# EAGLE schematic matrix (EAGLE 8.4.0)
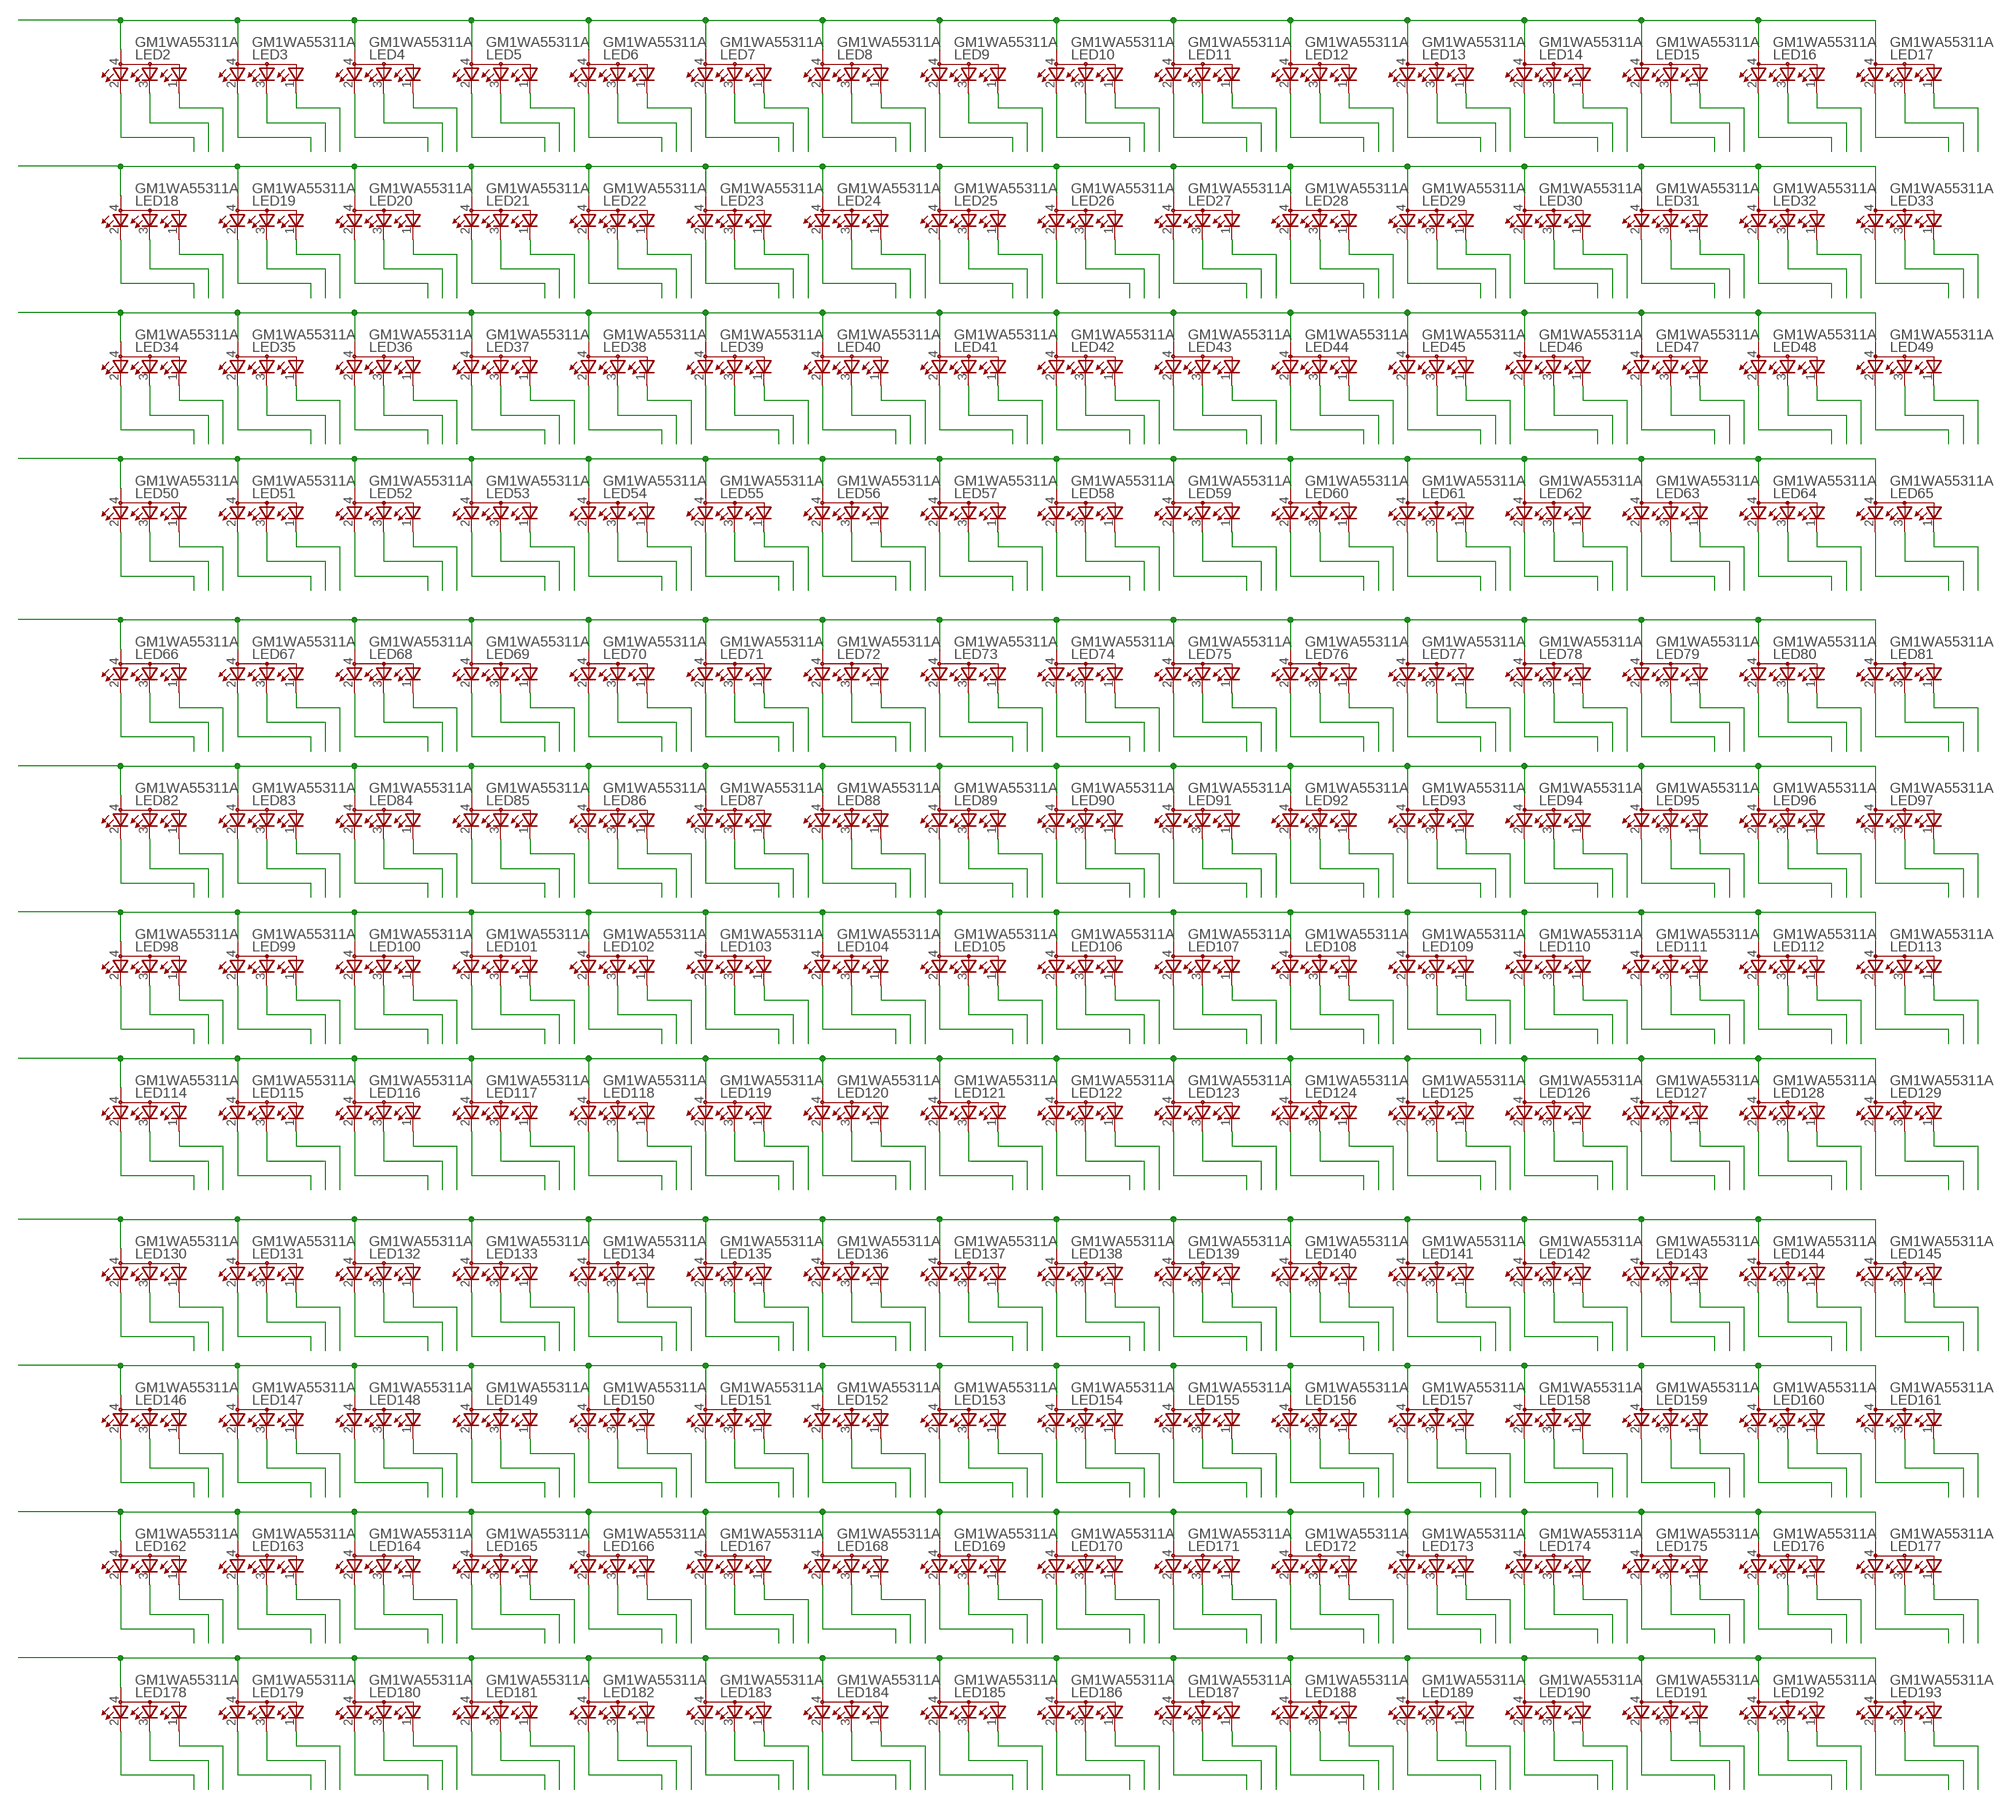
[diagram p0: schematic, sheet 1, part 1 of 3]
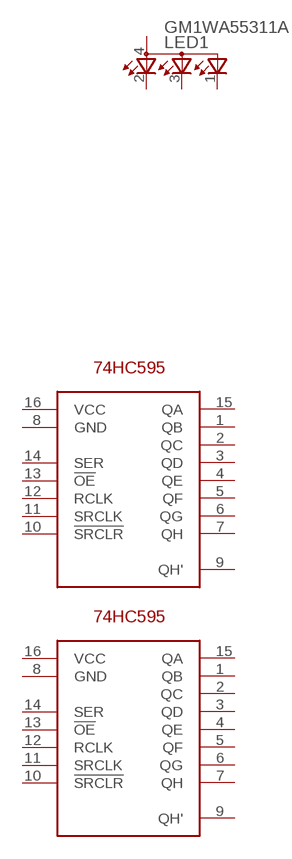
[diagram p1: schematic, sheet 1, part 2 of 3]
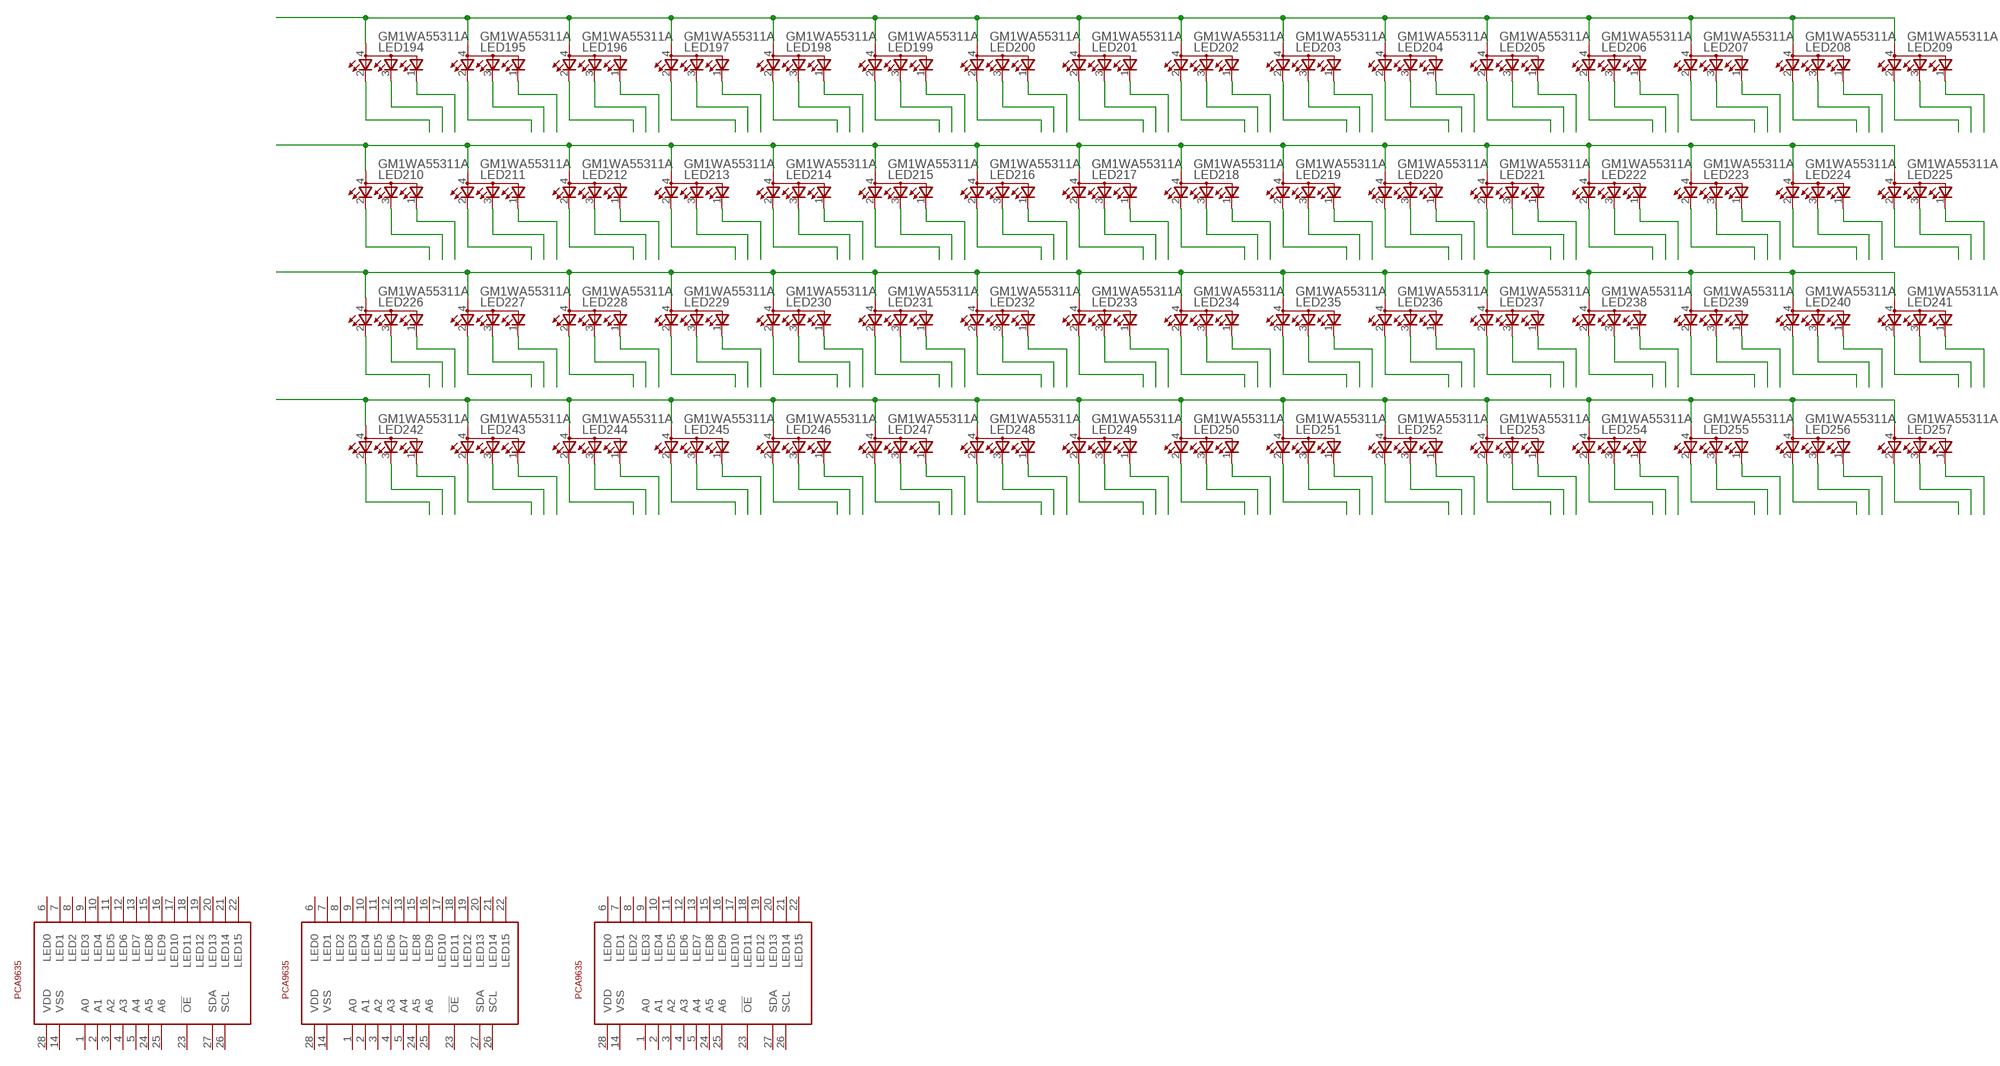
[diagram p2: schematic, sheet 1, part 3 of 3]

## Parts
LED1  GM1WA55311A  [GM1WA55311A]
LED2  GM1WA55311A  [GM1WA55311A]
LED3  GM1WA55311A  [GM1WA55311A]
LED4  GM1WA55311A  [GM1WA55311A]
LED5  GM1WA55311A  [GM1WA55311A]
LED6  GM1WA55311A  [GM1WA55311A]
LED7  GM1WA55311A  [GM1WA55311A]
LED8  GM1WA55311A  [GM1WA55311A]
LED9  GM1WA55311A  [GM1WA55311A]
LED10  GM1WA55311A  [GM1WA55311A]
LED11  GM1WA55311A  [GM1WA55311A]
LED12  GM1WA55311A  [GM1WA55311A]
LED13  GM1WA55311A  [GM1WA55311A]
LED14  GM1WA55311A  [GM1WA55311A]
LED15  GM1WA55311A  [GM1WA55311A]
LED16  GM1WA55311A  [GM1WA55311A]
LED17  GM1WA55311A  [GM1WA55311A]
LED18  GM1WA55311A  [GM1WA55311A]
LED19  GM1WA55311A  [GM1WA55311A]
LED20  GM1WA55311A  [GM1WA55311A]
LED21  GM1WA55311A  [GM1WA55311A]
LED22  GM1WA55311A  [GM1WA55311A]
LED23  GM1WA55311A  [GM1WA55311A]
LED24  GM1WA55311A  [GM1WA55311A]
LED25  GM1WA55311A  [GM1WA55311A]
LED26  GM1WA55311A  [GM1WA55311A]
LED27  GM1WA55311A  [GM1WA55311A]
LED28  GM1WA55311A  [GM1WA55311A]
LED29  GM1WA55311A  [GM1WA55311A]
LED30  GM1WA55311A  [GM1WA55311A]
LED31  GM1WA55311A  [GM1WA55311A]
LED32  GM1WA55311A  [GM1WA55311A]
LED33  GM1WA55311A  [GM1WA55311A]
LED34  GM1WA55311A  [GM1WA55311A]
LED35  GM1WA55311A  [GM1WA55311A]
LED36  GM1WA55311A  [GM1WA55311A]
LED37  GM1WA55311A  [GM1WA55311A]
LED38  GM1WA55311A  [GM1WA55311A]
LED39  GM1WA55311A  [GM1WA55311A]
LED40  GM1WA55311A  [GM1WA55311A]
LED41  GM1WA55311A  [GM1WA55311A]
LED42  GM1WA55311A  [GM1WA55311A]
LED43  GM1WA55311A  [GM1WA55311A]
LED44  GM1WA55311A  [GM1WA55311A]
LED45  GM1WA55311A  [GM1WA55311A]
LED46  GM1WA55311A  [GM1WA55311A]
LED47  GM1WA55311A  [GM1WA55311A]
LED48  GM1WA55311A  [GM1WA55311A]
LED49  GM1WA55311A  [GM1WA55311A]
LED50  GM1WA55311A  [GM1WA55311A]
LED51  GM1WA55311A  [GM1WA55311A]
LED52  GM1WA55311A  [GM1WA55311A]
LED53  GM1WA55311A  [GM1WA55311A]
LED54  GM1WA55311A  [GM1WA55311A]
LED55  GM1WA55311A  [GM1WA55311A]
LED56  GM1WA55311A  [GM1WA55311A]
LED57  GM1WA55311A  [GM1WA55311A]
LED58  GM1WA55311A  [GM1WA55311A]
LED59  GM1WA55311A  [GM1WA55311A]
LED60  GM1WA55311A  [GM1WA55311A]
LED61  GM1WA55311A  [GM1WA55311A]
LED62  GM1WA55311A  [GM1WA55311A]
LED63  GM1WA55311A  [GM1WA55311A]
LED64  GM1WA55311A  [GM1WA55311A]
LED65  GM1WA55311A  [GM1WA55311A]
LED66  GM1WA55311A  [GM1WA55311A]
LED67  GM1WA55311A  [GM1WA55311A]
LED68  GM1WA55311A  [GM1WA55311A]
LED69  GM1WA55311A  [GM1WA55311A]
LED70  GM1WA55311A  [GM1WA55311A]
LED71  GM1WA55311A  [GM1WA55311A]
LED72  GM1WA55311A  [GM1WA55311A]
LED73  GM1WA55311A  [GM1WA55311A]
LED74  GM1WA55311A  [GM1WA55311A]
LED75  GM1WA55311A  [GM1WA55311A]
LED76  GM1WA55311A  [GM1WA55311A]
LED77  GM1WA55311A  [GM1WA55311A]
LED78  GM1WA55311A  [GM1WA55311A]
LED79  GM1WA55311A  [GM1WA55311A]
LED80  GM1WA55311A  [GM1WA55311A]
LED81  GM1WA55311A  [GM1WA55311A]
LED82  GM1WA55311A  [GM1WA55311A]
LED83  GM1WA55311A  [GM1WA55311A]
LED84  GM1WA55311A  [GM1WA55311A]
LED85  GM1WA55311A  [GM1WA55311A]
LED86  GM1WA55311A  [GM1WA55311A]
LED87  GM1WA55311A  [GM1WA55311A]
LED88  GM1WA55311A  [GM1WA55311A]
LED89  GM1WA55311A  [GM1WA55311A]
LED90  GM1WA55311A  [GM1WA55311A]
LED91  GM1WA55311A  [GM1WA55311A]
LED92  GM1WA55311A  [GM1WA55311A]
LED93  GM1WA55311A  [GM1WA55311A]
LED94  GM1WA55311A  [GM1WA55311A]
LED95  GM1WA55311A  [GM1WA55311A]
LED96  GM1WA55311A  [GM1WA55311A]
LED97  GM1WA55311A  [GM1WA55311A]
LED98  GM1WA55311A  [GM1WA55311A]
LED99  GM1WA55311A  [GM1WA55311A]
LED100  GM1WA55311A  [GM1WA55311A]
LED101  GM1WA55311A  [GM1WA55311A]
LED102  GM1WA55311A  [GM1WA55311A]
LED103  GM1WA55311A  [GM1WA55311A]
LED104  GM1WA55311A  [GM1WA55311A]
LED105  GM1WA55311A  [GM1WA55311A]
LED106  GM1WA55311A  [GM1WA55311A]
LED107  GM1WA55311A  [GM1WA55311A]
LED108  GM1WA55311A  [GM1WA55311A]
LED109  GM1WA55311A  [GM1WA55311A]
LED110  GM1WA55311A  [GM1WA55311A]
LED111  GM1WA55311A  [GM1WA55311A]
LED112  GM1WA55311A  [GM1WA55311A]
LED113  GM1WA55311A  [GM1WA55311A]
LED114  GM1WA55311A  [GM1WA55311A]
LED115  GM1WA55311A  [GM1WA55311A]
LED116  GM1WA55311A  [GM1WA55311A]
LED117  GM1WA55311A  [GM1WA55311A]
LED118  GM1WA55311A  [GM1WA55311A]
LED119  GM1WA55311A  [GM1WA55311A]
LED120  GM1WA55311A  [GM1WA55311A]
LED121  GM1WA55311A  [GM1WA55311A]
LED122  GM1WA55311A  [GM1WA55311A]
LED123  GM1WA55311A  [GM1WA55311A]
LED124  GM1WA55311A  [GM1WA55311A]
LED125  GM1WA55311A  [GM1WA55311A]
LED126  GM1WA55311A  [GM1WA55311A]
LED127  GM1WA55311A  [GM1WA55311A]
LED128  GM1WA55311A  [GM1WA55311A]
LED129  GM1WA55311A  [GM1WA55311A]
LED130  GM1WA55311A  [GM1WA55311A]
LED131  GM1WA55311A  [GM1WA55311A]
LED132  GM1WA55311A  [GM1WA55311A]
LED133  GM1WA55311A  [GM1WA55311A]
LED134  GM1WA55311A  [GM1WA55311A]
LED135  GM1WA55311A  [GM1WA55311A]
LED136  GM1WA55311A  [GM1WA55311A]
LED137  GM1WA55311A  [GM1WA55311A]
LED138  GM1WA55311A  [GM1WA55311A]
LED139  GM1WA55311A  [GM1WA55311A]
LED140  GM1WA55311A  [GM1WA55311A]
LED141  GM1WA55311A  [GM1WA55311A]
LED142  GM1WA55311A  [GM1WA55311A]
LED143  GM1WA55311A  [GM1WA55311A]
LED144  GM1WA55311A  [GM1WA55311A]
LED145  GM1WA55311A  [GM1WA55311A]
LED146  GM1WA55311A  [GM1WA55311A]
LED147  GM1WA55311A  [GM1WA55311A]
LED148  GM1WA55311A  [GM1WA55311A]
LED149  GM1WA55311A  [GM1WA55311A]
LED150  GM1WA55311A  [GM1WA55311A]
LED151  GM1WA55311A  [GM1WA55311A]
LED152  GM1WA55311A  [GM1WA55311A]
LED153  GM1WA55311A  [GM1WA55311A]
LED154  GM1WA55311A  [GM1WA55311A]
LED155  GM1WA55311A  [GM1WA55311A]
LED156  GM1WA55311A  [GM1WA55311A]
LED157  GM1WA55311A  [GM1WA55311A]
LED158  GM1WA55311A  [GM1WA55311A]
LED159  GM1WA55311A  [GM1WA55311A]
LED160  GM1WA55311A  [GM1WA55311A]
LED161  GM1WA55311A  [GM1WA55311A]
LED162  GM1WA55311A  [GM1WA55311A]
LED163  GM1WA55311A  [GM1WA55311A]
LED164  GM1WA55311A  [GM1WA55311A]
LED165  GM1WA55311A  [GM1WA55311A]
LED166  GM1WA55311A  [GM1WA55311A]
LED167  GM1WA55311A  [GM1WA55311A]
LED168  GM1WA55311A  [GM1WA55311A]
LED169  GM1WA55311A  [GM1WA55311A]
LED170  GM1WA55311A  [GM1WA55311A]
LED171  GM1WA55311A  [GM1WA55311A]
LED172  GM1WA55311A  [GM1WA55311A]
LED173  GM1WA55311A  [GM1WA55311A]
LED174  GM1WA55311A  [GM1WA55311A]
LED175  GM1WA55311A  [GM1WA55311A]
LED176  GM1WA55311A  [GM1WA55311A]
LED177  GM1WA55311A  [GM1WA55311A]
LED178  GM1WA55311A  [GM1WA55311A]
LED179  GM1WA55311A  [GM1WA55311A]
LED180  GM1WA55311A  [GM1WA55311A]
LED181  GM1WA55311A  [GM1WA55311A]
LED182  GM1WA55311A  [GM1WA55311A]
LED183  GM1WA55311A  [GM1WA55311A]
LED184  GM1WA55311A  [GM1WA55311A]
LED185  GM1WA55311A  [GM1WA55311A]
LED186  GM1WA55311A  [GM1WA55311A]
LED187  GM1WA55311A  [GM1WA55311A]
LED188  GM1WA55311A  [GM1WA55311A]
LED189  GM1WA55311A  [GM1WA55311A]
LED190  GM1WA55311A  [GM1WA55311A]
LED191  GM1WA55311A  [GM1WA55311A]
LED192  GM1WA55311A  [GM1WA55311A]
LED193  GM1WA55311A  [GM1WA55311A]
LED194  GM1WA55311A  [GM1WA55311A]
LED195  GM1WA55311A  [GM1WA55311A]
LED196  GM1WA55311A  [GM1WA55311A]
LED197  GM1WA55311A  [GM1WA55311A]
LED198  GM1WA55311A  [GM1WA55311A]
LED199  GM1WA55311A  [GM1WA55311A]
LED200  GM1WA55311A  [GM1WA55311A]
LED201  GM1WA55311A  [GM1WA55311A]
LED202  GM1WA55311A  [GM1WA55311A]
LED203  GM1WA55311A  [GM1WA55311A]
LED204  GM1WA55311A  [GM1WA55311A]
LED205  GM1WA55311A  [GM1WA55311A]
LED206  GM1WA55311A  [GM1WA55311A]
LED207  GM1WA55311A  [GM1WA55311A]
LED208  GM1WA55311A  [GM1WA55311A]
LED209  GM1WA55311A  [GM1WA55311A]
LED210  GM1WA55311A  [GM1WA55311A]
LED211  GM1WA55311A  [GM1WA55311A]
LED212  GM1WA55311A  [GM1WA55311A]
LED213  GM1WA55311A  [GM1WA55311A]
LED214  GM1WA55311A  [GM1WA55311A]
LED215  GM1WA55311A  [GM1WA55311A]
LED216  GM1WA55311A  [GM1WA55311A]
LED217  GM1WA55311A  [GM1WA55311A]
LED218  GM1WA55311A  [GM1WA55311A]
LED219  GM1WA55311A  [GM1WA55311A]
LED220  GM1WA55311A  [GM1WA55311A]
LED221  GM1WA55311A  [GM1WA55311A]
LED222  GM1WA55311A  [GM1WA55311A]
LED223  GM1WA55311A  [GM1WA55311A]
LED224  GM1WA55311A  [GM1WA55311A]
LED225  GM1WA55311A  [GM1WA55311A]
LED226  GM1WA55311A  [GM1WA55311A]
LED227  GM1WA55311A  [GM1WA55311A]
LED228  GM1WA55311A  [GM1WA55311A]
LED229  GM1WA55311A  [GM1WA55311A]
LED230  GM1WA55311A  [GM1WA55311A]
LED231  GM1WA55311A  [GM1WA55311A]
LED232  GM1WA55311A  [GM1WA55311A]
LED233  GM1WA55311A  [GM1WA55311A]
LED234  GM1WA55311A  [GM1WA55311A]
LED235  GM1WA55311A  [GM1WA55311A]
LED236  GM1WA55311A  [GM1WA55311A]
LED237  GM1WA55311A  [GM1WA55311A]
LED238  GM1WA55311A  [GM1WA55311A]
LED239  GM1WA55311A  [GM1WA55311A]
LED240  GM1WA55311A  [GM1WA55311A]
LED241  GM1WA55311A  [GM1WA55311A]
LED242  GM1WA55311A  [GM1WA55311A]
LED243  GM1WA55311A  [GM1WA55311A]
LED244  GM1WA55311A  [GM1WA55311A]
LED245  GM1WA55311A  [GM1WA55311A]
LED246  GM1WA55311A  [GM1WA55311A]
LED247  GM1WA55311A  [GM1WA55311A]
LED248  GM1WA55311A  [GM1WA55311A]
LED249  GM1WA55311A  [GM1WA55311A]
LED250  GM1WA55311A  [GM1WA55311A]
LED251  GM1WA55311A  [GM1WA55311A]
LED252  GM1WA55311A  [GM1WA55311A]
LED253  GM1WA55311A  [GM1WA55311A]
LED254  GM1WA55311A  [GM1WA55311A]
LED255  GM1WA55311A  [GM1WA55311A]
LED256  GM1WA55311A  [GM1WA55311A]
LED257  GM1WA55311A  [GM1WA55311A]
U$1  PCA9635  [TSSOP28]
U$2  PCA9635  [TSSOP28]
U$3  PCA9635  [TSSOP28]
U$4  SN74HC595D  [SOIC16]
U$5  SN74HC595D  [SOIC16]

## Nets
N$1: LED2.1(CGREEN)
N$2: LED2.3(CBLUE)
N$3: LED2.2(CRED)
N$4: LED2.4(A) LED3.4(A) LED4.4(A) LED5.4(A) LED6.4(A) LED7.4(A) LED8.4(A) LED9.4(A) LED10.4(A) LED11.4(A) LED12.4(A) LED13.4(A) LED14.4(A) LED15.4(A) LED16.4(A) LED17.4(A)
N$5: LED3.1(CGREEN)
N$6: LED3.3(CBLUE)
N$7: LED3.2(CRED)
N$8: LED4.1(CGREEN)
N$9: LED4.3(CBLUE)
N$10: LED4.2(CRED)
N$11: LED5.1(CGREEN)
N$12: LED5.3(CBLUE)
N$13: LED5.2(CRED)
N$14: LED6.1(CGREEN)
N$15: LED6.3(CBLUE)
N$16: LED6.2(CRED)
N$17: LED7.1(CGREEN)
N$18: LED7.3(CBLUE)
N$19: LED7.2(CRED)
N$20: LED8.1(CGREEN)
N$21: LED8.3(CBLUE)
N$22: LED8.2(CRED)
N$23: LED9.1(CGREEN)
N$24: LED9.3(CBLUE)
N$25: LED9.2(CRED)
N$26: LED10.1(CGREEN)
N$27: LED10.3(CBLUE)
N$28: LED10.2(CRED)
N$29: LED11.1(CGREEN)
N$30: LED11.3(CBLUE)
N$31: LED11.2(CRED)
N$32: LED12.1(CGREEN)
N$33: LED12.3(CBLUE)
N$34: LED12.2(CRED)
N$35: LED13.1(CGREEN)
N$36: LED13.3(CBLUE)
N$37: LED13.2(CRED)
N$38: LED14.1(CGREEN)
N$39: LED14.3(CBLUE)
N$40: LED14.2(CRED)
N$41: LED15.1(CGREEN)
N$42: LED15.3(CBLUE)
N$43: LED15.2(CRED)
N$44: LED16.1(CGREEN)
N$45: LED16.3(CBLUE)
N$46: LED16.2(CRED)
N$47: LED17.1(CGREEN)
N$48: LED17.3(CBLUE)
N$49: LED17.2(CRED)
N$50: LED18.1(CGREEN)
N$51: LED18.3(CBLUE)
N$52: LED18.2(CRED)
N$53: LED18.4(A) LED19.4(A) LED20.4(A) LED21.4(A) LED22.4(A) LED23.4(A) LED24.4(A) LED25.4(A) LED26.4(A) LED27.4(A) LED28.4(A) LED29.4(A) LED30.4(A) LED31.4(A) LED32.4(A) LED33.4(A)
N$54: LED19.1(CGREEN)
N$55: LED19.3(CBLUE)
N$56: LED19.2(CRED)
N$57: LED20.1(CGREEN)
N$58: LED20.3(CBLUE)
N$59: LED20.2(CRED)
N$60: LED21.1(CGREEN)
N$61: LED21.3(CBLUE)
N$62: LED21.2(CRED)
N$63: LED22.1(CGREEN)
N$64: LED22.3(CBLUE)
N$65: LED22.2(CRED)
N$66: LED23.1(CGREEN)
N$67: LED23.3(CBLUE)
N$68: LED23.2(CRED)
N$69: LED24.1(CGREEN)
N$70: LED24.3(CBLUE)
N$71: LED24.2(CRED)
N$72: LED25.1(CGREEN)
N$73: LED25.3(CBLUE)
N$74: LED25.2(CRED)
N$75: LED26.1(CGREEN)
N$76: LED26.3(CBLUE)
N$77: LED26.2(CRED)
N$78: LED27.1(CGREEN)
N$79: LED27.3(CBLUE)
N$80: LED27.2(CRED)
N$81: LED28.1(CGREEN)
N$82: LED28.3(CBLUE)
N$83: LED28.2(CRED)
N$84: LED29.1(CGREEN)
N$85: LED29.3(CBLUE)
N$86: LED29.2(CRED)
N$87: LED30.1(CGREEN)
N$88: LED30.3(CBLUE)
N$89: LED30.2(CRED)
N$90: LED31.1(CGREEN)
N$91: LED31.3(CBLUE)
N$92: LED31.2(CRED)
N$93: LED32.1(CGREEN)
N$94: LED32.3(CBLUE)
N$95: LED32.2(CRED)
N$96: LED33.1(CGREEN)
N$97: LED33.3(CBLUE)
N$98: LED33.2(CRED)
N$99: LED34.1(CGREEN)
N$100: LED34.3(CBLUE)
N$101: LED34.2(CRED)
N$102: LED34.4(A) LED35.4(A) LED36.4(A) LED37.4(A) LED38.4(A) LED39.4(A) LED40.4(A) LED41.4(A) LED42.4(A) LED43.4(A) LED44.4(A) LED45.4(A) LED46.4(A) LED47.4(A) LED48.4(A) LED49.4(A)
N$103: LED35.1(CGREEN)
N$104: LED35.3(CBLUE)
N$105: LED35.2(CRED)
N$106: LED36.1(CGREEN)
N$107: LED36.3(CBLUE)
N$108: LED36.2(CRED)
N$109: LED37.1(CGREEN)
N$110: LED37.3(CBLUE)
N$111: LED37.2(CRED)
N$112: LED38.1(CGREEN)
N$113: LED38.3(CBLUE)
N$114: LED38.2(CRED)
N$115: LED39.1(CGREEN)
N$116: LED39.3(CBLUE)
N$117: LED39.2(CRED)
N$118: LED40.1(CGREEN)
N$119: LED40.3(CBLUE)
N$120: LED40.2(CRED)
N$121: LED41.1(CGREEN)
N$122: LED41.3(CBLUE)
N$123: LED41.2(CRED)
N$124: LED42.1(CGREEN)
N$125: LED42.3(CBLUE)
N$126: LED42.2(CRED)
N$127: LED43.1(CGREEN)
N$128: LED43.3(CBLUE)
N$129: LED43.2(CRED)
N$130: LED44.1(CGREEN)
N$131: LED44.3(CBLUE)
N$132: LED44.2(CRED)
N$133: LED45.1(CGREEN)
N$134: LED45.3(CBLUE)
N$135: LED45.2(CRED)
N$136: LED46.1(CGREEN)
N$137: LED46.3(CBLUE)
N$138: LED46.2(CRED)
N$139: LED47.1(CGREEN)
N$140: LED47.3(CBLUE)
N$141: LED47.2(CRED)
N$142: LED48.1(CGREEN)
N$143: LED48.3(CBLUE)
N$144: LED48.2(CRED)
N$145: LED49.1(CGREEN)
N$146: LED49.3(CBLUE)
N$147: LED49.2(CRED)
N$148: LED50.1(CGREEN)
N$149: LED50.3(CBLUE)
N$150: LED50.2(CRED)
N$151: LED50.4(A) LED51.4(A) LED52.4(A) LED53.4(A) LED54.4(A) LED55.4(A) LED56.4(A) LED57.4(A) LED58.4(A) LED59.4(A) LED60.4(A) LED61.4(A) LED62.4(A) LED63.4(A) LED64.4(A) LED65.4(A)
N$152: LED51.1(CGREEN)
N$153: LED51.3(CBLUE)
N$154: LED51.2(CRED)
N$155: LED52.1(CGREEN)
N$156: LED52.3(CBLUE)
N$157: LED52.2(CRED)
N$158: LED53.1(CGREEN)
N$159: LED53.3(CBLUE)
N$160: LED53.2(CRED)
N$161: LED54.1(CGREEN)
N$162: LED54.3(CBLUE)
N$163: LED54.2(CRED)
N$164: LED55.1(CGREEN)
N$165: LED55.3(CBLUE)
N$166: LED55.2(CRED)
N$167: LED56.1(CGREEN)
N$168: LED56.3(CBLUE)
N$169: LED56.2(CRED)
N$170: LED57.1(CGREEN)
N$171: LED57.3(CBLUE)
N$172: LED57.2(CRED)
N$173: LED58.1(CGREEN)
N$174: LED58.3(CBLUE)
N$175: LED58.2(CRED)
N$176: LED59.1(CGREEN)
N$177: LED59.3(CBLUE)
N$178: LED59.2(CRED)
N$179: LED60.1(CGREEN)
N$180: LED60.3(CBLUE)
N$181: LED60.2(CRED)
N$182: LED61.1(CGREEN)
N$183: LED61.3(CBLUE)
N$184: LED61.2(CRED)
N$185: LED62.1(CGREEN)
N$186: LED62.3(CBLUE)
N$187: LED62.2(CRED)
N$188: LED63.1(CGREEN)
N$189: LED63.3(CBLUE)
N$190: LED63.2(CRED)
N$191: LED64.1(CGREEN)
N$192: LED64.3(CBLUE)
N$193: LED64.2(CRED)
N$194: LED65.1(CGREEN)
N$195: LED65.3(CBLUE)
N$196: LED65.2(CRED)
N$197: LED66.1(CGREEN)
N$198: LED66.3(CBLUE)
N$199: LED66.2(CRED)
N$200: LED66.4(A) LED67.4(A) LED68.4(A) LED69.4(A) LED70.4(A) LED71.4(A) LED72.4(A) LED73.4(A) LED74.4(A) LED75.4(A) LED76.4(A) LED77.4(A) LED78.4(A) LED79.4(A) LED80.4(A) LED81.4(A)
N$201: LED67.1(CGREEN)
N$202: LED67.3(CBLUE)
N$203: LED67.2(CRED)
N$204: LED68.1(CGREEN)
N$205: LED68.3(CBLUE)
N$206: LED68.2(CRED)
N$207: LED69.1(CGREEN)
N$208: LED69.3(CBLUE)
N$209: LED69.2(CRED)
N$210: LED70.1(CGREEN)
N$211: LED70.3(CBLUE)
N$212: LED70.2(CRED)
N$213: LED71.1(CGREEN)
N$214: LED71.3(CBLUE)
N$215: LED71.2(CRED)
N$216: LED72.1(CGREEN)
N$217: LED72.3(CBLUE)
N$218: LED72.2(CRED)
N$219: LED73.1(CGREEN)
N$220: LED73.3(CBLUE)
N$221: LED73.2(CRED)
N$222: LED74.1(CGREEN)
N$223: LED74.3(CBLUE)
N$224: LED74.2(CRED)
N$225: LED75.1(CGREEN)
N$226: LED75.3(CBLUE)
N$227: LED75.2(CRED)
N$228: LED76.1(CGREEN)
N$229: LED76.3(CBLUE)
N$230: LED76.2(CRED)
N$231: LED77.1(CGREEN)
N$232: LED77.3(CBLUE)
N$233: LED77.2(CRED)
N$234: LED78.1(CGREEN)
N$235: LED78.3(CBLUE)
N$236: LED78.2(CRED)
N$237: LED79.1(CGREEN)
N$238: LED79.3(CBLUE)
N$239: LED79.2(CRED)
N$240: LED80.1(CGREEN)
N$241: LED80.3(CBLUE)
N$242: LED80.2(CRED)
N$243: LED81.1(CGREEN)
N$244: LED81.3(CBLUE)
N$245: LED81.2(CRED)
N$246: LED82.1(CGREEN)
N$247: LED82.3(CBLUE)
N$248: LED82.2(CRED)
N$249: LED82.4(A) LED83.4(A) LED84.4(A) LED85.4(A) LED86.4(A) LED87.4(A) LED88.4(A) LED89.4(A) LED90.4(A) LED91.4(A) LED92.4(A) LED93.4(A) LED94.4(A) LED95.4(A) LED96.4(A) LED97.4(A)
N$250: LED83.1(CGREEN)
N$251: LED83.3(CBLUE)
N$252: LED83.2(CRED)
N$253: LED84.1(CGREEN)
N$254: LED84.3(CBLUE)
N$255: LED84.2(CRED)
N$256: LED85.1(CGREEN)
N$257: LED85.3(CBLUE)
N$258: LED85.2(CRED)
N$259: LED86.1(CGREEN)
N$260: LED86.3(CBLUE)
N$261: LED86.2(CRED)
N$262: LED87.1(CGREEN)
N$263: LED87.3(CBLUE)
N$264: LED87.2(CRED)
N$265: LED88.1(CGREEN)
N$266: LED88.3(CBLUE)
N$267: LED88.2(CRED)
N$268: LED89.1(CGREEN)
N$269: LED89.3(CBLUE)
N$270: LED89.2(CRED)
N$271: LED90.1(CGREEN)
N$272: LED90.3(CBLUE)
N$273: LED90.2(CRED)
N$274: LED91.1(CGREEN)
N$275: LED91.3(CBLUE)
N$276: LED91.2(CRED)
N$277: LED92.1(CGREEN)
N$278: LED92.3(CBLUE)
N$279: LED92.2(CRED)
N$280: LED93.1(CGREEN)
N$281: LED93.3(CBLUE)
N$282: LED93.2(CRED)
N$283: LED94.1(CGREEN)
N$284: LED94.3(CBLUE)
N$285: LED94.2(CRED)
N$286: LED95.1(CGREEN)
N$287: LED95.3(CBLUE)
N$288: LED95.2(CRED)
N$289: LED96.1(CGREEN)
N$290: LED96.3(CBLUE)
N$291: LED96.2(CRED)
N$292: LED97.1(CGREEN)
N$293: LED97.3(CBLUE)
N$294: LED97.2(CRED)
N$295: LED98.1(CGREEN)
N$296: LED98.3(CBLUE)
N$297: LED98.2(CRED)
N$298: LED98.4(A) LED99.4(A) LED100.4(A) LED101.4(A) LED102.4(A) LED103.4(A) LED104.4(A) LED105.4(A) LED106.4(A) LED107.4(A) LED108.4(A) LED109.4(A) LED110.4(A) LED111.4(A) LED112.4(A) LED113.4(A)
N$299: LED99.1(CGREEN)
N$300: LED99.3(CBLUE)
N$301: LED99.2(CRED)
N$302: LED100.1(CGREEN)
N$303: LED100.3(CBLUE)
N$304: LED100.2(CRED)
N$305: LED101.1(CGREEN)
N$306: LED101.3(CBLUE)
N$307: LED101.2(CRED)
N$308: LED102.1(CGREEN)
N$309: LED102.3(CBLUE)
N$310: LED102.2(CRED)
N$311: LED103.1(CGREEN)
N$312: LED103.3(CBLUE)
N$313: LED103.2(CRED)
N$314: LED104.1(CGREEN)
N$315: LED104.3(CBLUE)
N$316: LED104.2(CRED)
N$317: LED105.1(CGREEN)
N$318: LED105.3(CBLUE)
N$319: LED105.2(CRED)
N$320: LED106.1(CGREEN)
N$321: LED106.3(CBLUE)
N$322: LED106.2(CRED)
N$323: LED107.1(CGREEN)
N$324: LED107.3(CBLUE)
N$325: LED107.2(CRED)
N$326: LED108.1(CGREEN)
N$327: LED108.3(CBLUE)
N$328: LED108.2(CRED)
N$329: LED109.1(CGREEN)
N$330: LED109.3(CBLUE)
N$331: LED109.2(CRED)
N$332: LED110.1(CGREEN)
N$333: LED110.3(CBLUE)
N$334: LED110.2(CRED)
N$335: LED111.1(CGREEN)
N$336: LED111.3(CBLUE)
N$337: LED111.2(CRED)
N$338: LED112.1(CGREEN)
N$339: LED112.3(CBLUE)
N$340: LED112.2(CRED)
N$341: LED113.1(CGREEN)
N$342: LED113.3(CBLUE)
N$343: LED113.2(CRED)
N$344: LED114.1(CGREEN)
N$345: LED114.3(CBLUE)
N$346: LED114.2(CRED)
N$347: LED114.4(A) LED115.4(A) LED116.4(A) LED117.4(A) LED118.4(A) LED119.4(A) LED120.4(A) LED121.4(A) LED122.4(A) LED123.4(A) LED124.4(A) LED125.4(A) LED126.4(A) LED127.4(A) LED128.4(A) LED129.4(A)
N$348: LED115.1(CGREEN)
N$349: LED115.3(CBLUE)
N$350: LED115.2(CRED)
N$351: LED116.1(CGREEN)
N$352: LED116.3(CBLUE)
N$353: LED116.2(CRED)
N$354: LED117.1(CGREEN)
N$355: LED117.3(CBLUE)
N$356: LED117.2(CRED)
N$357: LED118.1(CGREEN)
N$358: LED118.3(CBLUE)
N$359: LED118.2(CRED)
N$360: LED119.1(CGREEN)
N$361: LED119.3(CBLUE)
N$362: LED119.2(CRED)
N$363: LED120.1(CGREEN)
N$364: LED120.3(CBLUE)
N$365: LED120.2(CRED)
N$366: LED121.1(CGREEN)
N$367: LED121.3(CBLUE)
N$368: LED121.2(CRED)
N$369: LED122.1(CGREEN)
N$370: LED122.3(CBLUE)
N$371: LED122.2(CRED)
N$372: LED123.1(CGREEN)
N$373: LED123.3(CBLUE)
N$374: LED123.2(CRED)
N$375: LED124.1(CGREEN)
N$376: LED124.3(CBLUE)
N$377: LED124.2(CRED)
N$378: LED125.1(CGREEN)
N$379: LED125.3(CBLUE)
N$380: LED125.2(CRED)
N$381: LED126.1(CGREEN)
N$382: LED126.3(CBLUE)
N$383: LED126.2(CRED)
N$384: LED127.1(CGREEN)
N$385: LED127.3(CBLUE)
N$386: LED127.2(CRED)
N$387: LED128.1(CGREEN)
N$388: LED128.3(CBLUE)
N$389: LED128.2(CRED)
N$390: LED129.1(CGREEN)
N$391: LED129.3(CBLUE)
N$392: LED129.2(CRED)
N$393: LED130.1(CGREEN)
N$394: LED130.3(CBLUE)
N$395: LED130.2(CRED)
N$396: LED130.4(A) LED131.4(A) LED132.4(A) LED133.4(A) LED134.4(A) LED135.4(A) LED136.4(A) LED137.4(A) LED138.4(A) LED139.4(A) LED140.4(A) LED141.4(A) LED142.4(A) LED143.4(A) LED144.4(A) LED145.4(A)
N$397: LED131.1(CGREEN)
N$398: LED131.3(CBLUE)
N$399: LED131.2(CRED)
N$400: LED132.1(CGREEN)
N$401: LED132.3(CBLUE)
N$402: LED132.2(CRED)
N$403: LED133.1(CGREEN)
N$404: LED133.3(CBLUE)
N$405: LED133.2(CRED)
N$406: LED134.1(CGREEN)
N$407: LED134.3(CBLUE)
N$408: LED134.2(CRED)
N$409: LED135.1(CGREEN)
N$410: LED135.3(CBLUE)
N$411: LED135.2(CRED)
N$412: LED136.1(CGREEN)
N$413: LED136.3(CBLUE)
N$414: LED136.2(CRED)
N$415: LED137.1(CGREEN)
N$416: LED137.3(CBLUE)
N$417: LED137.2(CRED)
N$418: LED138.1(CGREEN)
N$419: LED138.3(CBLUE)
N$420: LED138.2(CRED)
N$421: LED139.1(CGREEN)
N$422: LED139.3(CBLUE)
N$423: LED139.2(CRED)
N$424: LED140.1(CGREEN)
N$425: LED140.3(CBLUE)
N$426: LED140.2(CRED)
N$427: LED141.1(CGREEN)
N$428: LED141.3(CBLUE)
N$429: LED141.2(CRED)
N$430: LED142.1(CGREEN)
N$431: LED142.3(CBLUE)
N$432: LED142.2(CRED)
N$433: LED143.1(CGREEN)
N$434: LED143.3(CBLUE)
N$435: LED143.2(CRED)
N$436: LED144.1(CGREEN)
N$437: LED144.3(CBLUE)
N$438: LED144.2(CRED)
N$439: LED145.1(CGREEN)
N$440: LED145.3(CBLUE)
N$441: LED145.2(CRED)
N$442: LED146.1(CGREEN)
N$443: LED146.3(CBLUE)
N$444: LED146.2(CRED)
N$445: LED146.4(A) LED147.4(A) LED148.4(A) LED149.4(A) LED150.4(A) LED151.4(A) LED152.4(A) LED153.4(A) LED154.4(A) LED155.4(A) LED156.4(A) LED157.4(A) LED158.4(A) LED159.4(A) LED160.4(A) LED161.4(A)
N$446: LED147.1(CGREEN)
N$447: LED147.3(CBLUE)
N$448: LED147.2(CRED)
N$449: LED148.1(CGREEN)
N$450: LED148.3(CBLUE)
N$451: LED148.2(CRED)
N$452: LED149.1(CGREEN)
N$453: LED149.3(CBLUE)
N$454: LED149.2(CRED)
N$455: LED150.1(CGREEN)
N$456: LED150.3(CBLUE)
N$457: LED150.2(CRED)
N$458: LED151.1(CGREEN)
N$459: LED151.3(CBLUE)
N$460: LED151.2(CRED)
N$461: LED152.1(CGREEN)
N$462: LED152.3(CBLUE)
N$463: LED152.2(CRED)
N$464: LED153.1(CGREEN)
N$465: LED153.3(CBLUE)
N$466: LED153.2(CRED)
N$467: LED154.1(CGREEN)
N$468: LED154.3(CBLUE)
N$469: LED154.2(CRED)
N$470: LED155.1(CGREEN)
N$471: LED155.3(CBLUE)
N$472: LED155.2(CRED)
N$473: LED156.1(CGREEN)
N$474: LED156.3(CBLUE)
N$475: LED156.2(CRED)
N$476: LED157.1(CGREEN)
N$477: LED157.3(CBLUE)
N$478: LED157.2(CRED)
N$479: LED158.1(CGREEN)
N$480: LED158.3(CBLUE)
N$481: LED158.2(CRED)
N$482: LED159.1(CGREEN)
N$483: LED159.3(CBLUE)
N$484: LED159.2(CRED)
N$485: LED160.1(CGREEN)
N$486: LED160.3(CBLUE)
N$487: LED160.2(CRED)
N$488: LED161.1(CGREEN)
N$489: LED161.3(CBLUE)
N$490: LED161.2(CRED)
N$491: LED162.1(CGREEN)
N$492: LED162.3(CBLUE)
N$493: LED162.2(CRED)
N$494: LED162.4(A) LED163.4(A) LED164.4(A) LED165.4(A) LED166.4(A) LED167.4(A) LED168.4(A) LED169.4(A) LED170.4(A) LED171.4(A) LED172.4(A) LED173.4(A) LED174.4(A) LED175.4(A) LED176.4(A) LED177.4(A)
N$495: LED163.1(CGREEN)
N$496: LED163.3(CBLUE)
N$497: LED163.2(CRED)
N$498: LED164.1(CGREEN)
N$499: LED164.3(CBLUE)
N$500: LED164.2(CRED)
N$501: LED165.1(CGREEN)
N$502: LED165.3(CBLUE)
N$503: LED165.2(CRED)
N$504: LED166.1(CGREEN)
N$505: LED166.3(CBLUE)
N$506: LED166.2(CRED)
N$507: LED167.1(CGREEN)
N$508: LED167.3(CBLUE)
N$509: LED167.2(CRED)
N$510: LED168.1(CGREEN)
N$511: LED168.3(CBLUE)
N$512: LED168.2(CRED)
N$513: LED169.1(CGREEN)
N$514: LED169.3(CBLUE)
N$515: LED169.2(CRED)
N$516: LED170.1(CGREEN)
N$517: LED170.3(CBLUE)
N$518: LED170.2(CRED)
N$519: LED171.1(CGREEN)
N$520: LED171.3(CBLUE)
N$521: LED171.2(CRED)
N$522: LED172.1(CGREEN)
N$523: LED172.3(CBLUE)
N$524: LED172.2(CRED)
N$525: LED173.1(CGREEN)
N$526: LED173.3(CBLUE)
N$527: LED173.2(CRED)
N$528: LED174.1(CGREEN)
N$529: LED174.3(CBLUE)
N$530: LED174.2(CRED)
N$531: LED175.1(CGREEN)
N$532: LED175.3(CBLUE)
N$533: LED175.2(CRED)
N$534: LED176.1(CGREEN)
N$535: LED176.3(CBLUE)
N$536: LED176.2(CRED)
N$537: LED177.1(CGREEN)
N$538: LED177.3(CBLUE)
N$539: LED177.2(CRED)
N$540: LED178.1(CGREEN)
N$541: LED178.3(CBLUE)
N$542: LED178.2(CRED)
N$543: LED178.4(A) LED179.4(A) LED180.4(A) LED181.4(A) LED182.4(A) LED183.4(A) LED184.4(A) LED185.4(A) LED186.4(A) LED187.4(A) LED188.4(A) LED189.4(A) LED190.4(A) LED191.4(A) LED192.4(A) LED193.4(A)
N$544: LED179.1(CGREEN)
N$545: LED179.3(CBLUE)
N$546: LED179.2(CRED)
N$547: LED180.1(CGREEN)
N$548: LED180.3(CBLUE)
N$549: LED180.2(CRED)
N$550: LED181.1(CGREEN)
N$551: LED181.3(CBLUE)
N$552: LED181.2(CRED)
N$553: LED182.1(CGREEN)
N$554: LED182.3(CBLUE)
N$555: LED182.2(CRED)
N$556: LED183.1(CGREEN)
N$557: LED183.3(CBLUE)
N$558: LED183.2(CRED)
N$559: LED184.1(CGREEN)
N$560: LED184.3(CBLUE)
N$561: LED184.2(CRED)
N$562: LED185.1(CGREEN)
N$563: LED185.3(CBLUE)
N$564: LED185.2(CRED)
N$565: LED186.1(CGREEN)
N$566: LED186.3(CBLUE)
N$567: LED186.2(CRED)
N$568: LED187.1(CGREEN)
N$569: LED187.3(CBLUE)
N$570: LED187.2(CRED)
N$571: LED188.1(CGREEN)
N$572: LED188.3(CBLUE)
N$573: LED188.2(CRED)
N$574: LED189.1(CGREEN)
N$575: LED189.3(CBLUE)
N$576: LED189.2(CRED)
N$577: LED190.1(CGREEN)
N$578: LED190.3(CBLUE)
N$579: LED190.2(CRED)
N$580: LED191.1(CGREEN)
N$581: LED191.3(CBLUE)
N$582: LED191.2(CRED)
N$583: LED192.1(CGREEN)
N$584: LED192.3(CBLUE)
N$585: LED192.2(CRED)
N$586: LED193.1(CGREEN)
N$587: LED193.3(CBLUE)
N$588: LED193.2(CRED)
N$589: LED194.1(CGREEN)
N$590: LED194.3(CBLUE)
N$591: LED194.2(CRED)
N$592: LED194.4(A) LED195.4(A) LED196.4(A) LED197.4(A) LED198.4(A) LED199.4(A) LED200.4(A) LED201.4(A) LED202.4(A) LED203.4(A) LED204.4(A) LED205.4(A) LED206.4(A) LED207.4(A) LED208.4(A) LED209.4(A)
N$593: LED195.1(CGREEN)
N$594: LED195.3(CBLUE)
N$595: LED195.2(CRED)
N$596: LED196.1(CGREEN)
N$597: LED196.3(CBLUE)
N$598: LED196.2(CRED)
N$599: LED197.1(CGREEN)
N$600: LED197.3(CBLUE)
N$601: LED197.2(CRED)
N$602: LED198.1(CGREEN)
N$603: LED198.3(CBLUE)
N$604: LED198.2(CRED)
N$605: LED199.1(CGREEN)
N$606: LED199.3(CBLUE)
N$607: LED199.2(CRED)
N$608: LED200.1(CGREEN)
N$609: LED200.3(CBLUE)
N$610: LED200.2(CRED)
N$611: LED201.1(CGREEN)
N$612: LED201.3(CBLUE)
N$613: LED201.2(CRED)
N$614: LED202.1(CGREEN)
N$615: LED202.3(CBLUE)
N$616: LED202.2(CRED)
N$617: LED203.1(CGREEN)
N$618: LED203.3(CBLUE)
N$619: LED203.2(CRED)
N$620: LED204.1(CGREEN)
N$621: LED204.3(CBLUE)
N$622: LED204.2(CRED)
N$623: LED205.1(CGREEN)
N$624: LED205.3(CBLUE)
N$625: LED205.2(CRED)
N$626: LED206.1(CGREEN)
N$627: LED206.3(CBLUE)
N$628: LED206.2(CRED)
N$629: LED207.1(CGREEN)
N$630: LED207.3(CBLUE)
N$631: LED207.2(CRED)
N$632: LED208.1(CGREEN)
N$633: LED208.3(CBLUE)
N$634: LED208.2(CRED)
N$635: LED209.1(CGREEN)
N$636: LED209.3(CBLUE)
N$637: LED209.2(CRED)
N$638: LED210.1(CGREEN)
N$639: LED210.3(CBLUE)
N$640: LED210.2(CRED)
N$641: LED210.4(A) LED211.4(A) LED212.4(A) LED213.4(A) LED214.4(A) LED215.4(A) LED216.4(A) LED217.4(A) LED218.4(A) LED219.4(A) LED220.4(A) LED221.4(A) LED222.4(A) LED223.4(A) LED224.4(A) LED225.4(A)
N$642: LED211.1(CGREEN)
N$643: LED211.3(CBLUE)
N$644: LED211.2(CRED)
N$645: LED212.1(CGREEN)
N$646: LED212.3(CBLUE)
N$647: LED212.2(CRED)
N$648: LED213.1(CGREEN)
N$649: LED213.3(CBLUE)
N$650: LED213.2(CRED)
N$651: LED214.1(CGREEN)
N$652: LED214.3(CBLUE)
N$653: LED214.2(CRED)
N$654: LED215.1(CGREEN)
N$655: LED215.3(CBLUE)
N$656: LED215.2(CRED)
N$657: LED216.1(CGREEN)
N$658: LED216.3(CBLUE)
N$659: LED216.2(CRED)
N$660: LED217.1(CGREEN)
N$661: LED217.3(CBLUE)
N$662: LED217.2(CRED)
N$663: LED218.1(CGREEN)
N$664: LED218.3(CBLUE)
N$665: LED218.2(CRED)
N$666: LED219.1(CGREEN)
N$667: LED219.3(CBLUE)
N$668: LED219.2(CRED)
N$669: LED220.1(CGREEN)
N$670: LED220.3(CBLUE)
N$671: LED220.2(CRED)
N$672: LED221.1(CGREEN)
N$673: LED221.3(CBLUE)
N$674: LED221.2(CRED)
N$675: LED222.1(CGREEN)
N$676: LED222.3(CBLUE)
N$677: LED222.2(CRED)
N$678: LED223.1(CGREEN)
N$679: LED223.3(CBLUE)
N$680: LED223.2(CRED)
N$681: LED224.1(CGREEN)
N$682: LED224.3(CBLUE)
N$683: LED224.2(CRED)
N$684: LED225.1(CGREEN)
N$685: LED225.3(CBLUE)
N$686: LED225.2(CRED)
N$687: LED226.1(CGREEN)
N$688: LED226.3(CBLUE)
N$689: LED226.2(CRED)
N$690: LED226.4(A) LED227.4(A) LED228.4(A) LED229.4(A) LED230.4(A) LED231.4(A) LED232.4(A) LED233.4(A) LED234.4(A) LED235.4(A) LED236.4(A) LED237.4(A) LED238.4(A) LED239.4(A) LED240.4(A) LED241.4(A)
N$691: LED227.1(CGREEN)
N$692: LED227.3(CBLUE)
N$693: LED227.2(CRED)
N$694: LED228.1(CGREEN)
N$695: LED228.3(CBLUE)
N$696: LED228.2(CRED)
N$697: LED229.1(CGREEN)
N$698: LED229.3(CBLUE)
N$699: LED229.2(CRED)
N$700: LED230.1(CGREEN)
N$701: LED230.3(CBLUE)
N$702: LED230.2(CRED)
N$703: LED231.1(CGREEN)
N$704: LED231.3(CBLUE)
N$705: LED231.2(CRED)
N$706: LED232.1(CGREEN)
N$707: LED232.3(CBLUE)
N$708: LED232.2(CRED)
N$709: LED233.1(CGREEN)
N$710: LED233.3(CBLUE)
N$711: LED233.2(CRED)
N$712: LED234.1(CGREEN)
N$713: LED234.3(CBLUE)
N$714: LED234.2(CRED)
N$715: LED235.1(CGREEN)
N$716: LED235.3(CBLUE)
N$717: LED235.2(CRED)
N$718: LED236.1(CGREEN)
N$719: LED236.3(CBLUE)
N$720: LED236.2(CRED)
N$721: LED237.1(CGREEN)
N$722: LED237.3(CBLUE)
N$723: LED237.2(CRED)
N$724: LED238.1(CGREEN)
N$725: LED238.3(CBLUE)
N$726: LED238.2(CRED)
N$727: LED239.1(CGREEN)
N$728: LED239.3(CBLUE)
N$729: LED239.2(CRED)
N$730: LED240.1(CGREEN)
N$731: LED240.3(CBLUE)
N$732: LED240.2(CRED)
N$733: LED241.1(CGREEN)
N$734: LED241.3(CBLUE)
N$735: LED241.2(CRED)
N$736: LED242.1(CGREEN)
N$737: LED242.3(CBLUE)
N$738: LED242.2(CRED)
N$739: LED242.4(A) LED243.4(A) LED244.4(A) LED245.4(A) LED246.4(A) LED247.4(A) LED248.4(A) LED249.4(A) LED250.4(A) LED251.4(A) LED252.4(A) LED253.4(A) LED254.4(A) LED255.4(A) LED256.4(A) LED257.4(A)
N$740: LED243.1(CGREEN)
N$741: LED243.3(CBLUE)
N$742: LED243.2(CRED)
N$743: LED244.1(CGREEN)
N$744: LED244.3(CBLUE)
N$745: LED244.2(CRED)
N$746: LED245.1(CGREEN)
N$747: LED245.3(CBLUE)
N$748: LED245.2(CRED)
N$749: LED246.1(CGREEN)
N$750: LED246.3(CBLUE)
N$751: LED246.2(CRED)
N$752: LED247.1(CGREEN)
N$753: LED247.3(CBLUE)
N$754: LED247.2(CRED)
N$755: LED248.1(CGREEN)
N$756: LED248.3(CBLUE)
N$757: LED248.2(CRED)
N$758: LED249.1(CGREEN)
N$759: LED249.3(CBLUE)
N$760: LED249.2(CRED)
N$761: LED250.1(CGREEN)
N$762: LED250.3(CBLUE)
N$763: LED250.2(CRED)
N$764: LED251.1(CGREEN)
N$765: LED251.3(CBLUE)
N$766: LED251.2(CRED)
N$767: LED252.1(CGREEN)
N$768: LED252.3(CBLUE)
N$769: LED252.2(CRED)
N$770: LED253.1(CGREEN)
N$771: LED253.3(CBLUE)
N$772: LED253.2(CRED)
N$773: LED254.1(CGREEN)
N$774: LED254.3(CBLUE)
N$775: LED254.2(CRED)
N$776: LED255.1(CGREEN)
N$777: LED255.3(CBLUE)
N$778: LED255.2(CRED)
N$779: LED256.1(CGREEN)
N$780: LED256.3(CBLUE)
N$781: LED256.2(CRED)
N$782: LED257.1(CGREEN)
N$783: LED257.3(CBLUE)
N$784: LED257.2(CRED)
Unconnected: LED1.1(CGREEN) LED1.2(CRED) LED1.3(CBLUE) LED1.4(A) U$1.1(A0) U$1.2(A1) U$1.3(A2) U$1.4(A3) U$1.5(A4) U$1.6(LED0) U$1.7(LED1) U$1.8(LED2) U$1.9(LED3) U$1.10(LED4) U$1.11(LED5) U$1.12(LED6) U$1.13(LED7) U$1.15(LED8) U$1.16(LED9) U$1.17(LED10) U$1.18(LED11) U$1.19(LED12) U$1.20(LED13) U$1.21(LED14) U$1.22(LED15) U$1.23(!OE) U$1.24(A5) U$1.25(A6) U$1.26(SCL) U$1.27(SDA) U$2.1(A0) U$2.2(A1) U$2.3(A2) U$2.4(A3) U$2.5(A4) U$2.6(LED0) U$2.7(LED1) U$2.8(LED2) U$2.9(LED3) U$2.10(LED4) U$2.11(LED5) U$2.12(LED6) U$2.13(LED7) U$2.15(LED8) U$2.16(LED9) U$2.17(LED10) U$2.18(LED11) U$2.19(LED12) U$2.20(LED13) U$2.21(LED14) U$2.22(LED15) U$2.23(!OE) U$2.24(A5) U$2.25(A6) U$2.26(SCL) U$2.27(SDA) U$3.1(A0) U$3.2(A1) U$3.3(A2) U$3.4(A3) U$3.5(A4) U$3.6(LED0) U$3.7(LED1) U$3.8(LED2) U$3.9(LED3) U$3.10(LED4) U$3.11(LED5) U$3.12(LED6) U$3.13(LED7) U$3.15(LED8) U$3.16(LED9) U$3.17(LED10) U$3.18(LED11) U$3.19(LED12) U$3.20(LED13) U$3.21(LED14) U$3.22(LED15) U$3.23(!OE) U$3.24(A5) U$3.25(A6) U$3.26(SCL) U$3.27(SDA) U$4.1(QB) U$4.2(QC) U$4.3(QD) U$4.4(QE) U$4.5(QF) U$4.6(QG) U$4.7(QH) U$4.9(QH') U$4.10(!SRCLR) U$4.11(SRCLK) U$4.12(RCLK) U$4.13(!OE) U$4.14(SER) U$4.15(QA) U$5.1(QB) U$5.2(QC) U$5.3(QD) U$5.4(QE) U$5.5(QF) U$5.6(QG) U$5.7(QH) U$5.9(QH') U$5.10(!SRCLR) U$5.11(SRCLK) U$5.12(RCLK) U$5.13(!OE) U$5.14(SER) U$5.15(QA)

## Power pins joined to a net without a drawn wire
GND: U$4.8(GND) U$5.8(GND)
VCC: U$4.16(VCC) U$5.16(VCC)
VDD: U$1.28(VDD) U$2.28(VDD) U$3.28(VDD)
VSS: U$1.14(VSS) U$2.14(VSS) U$3.14(VSS)

## Library data of the parts
LED1-LED257 = led:GM1WA55311A: Chip LED RGB Source: http://document.sharpsma.com/files/GM1WA55311A_SS.pdf
U$1-U$3 = pca9635:PCA9635: PCA9635 LED PWM Driver. With I2C
U$4 U$5 = 74hc595:SN74HC595D: 74HC595 Shift Register SOIC16 Package Variant